# Altium schematic sheet ST-Link_V2.SchDoc
size A4; SheetNumber: 3; SheetTotal: 6
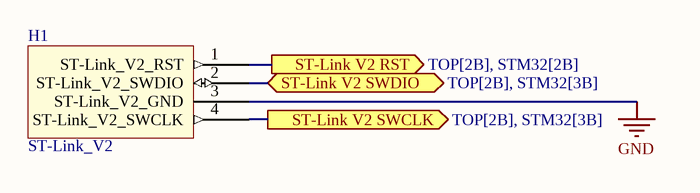
[diagram p0: ST-Link_V2.SchDoc]

## Parts
H1  ST-Link_V2  [4pin]

## Ports
ST-Link V2 RST (out, see TOP[2B], STM32[2B]), ST-Link V2 SWCLK (out, see TOP[2B], STM32[3B]), ST-Link V2 SWDIO (bidir, see TOP[2B], STM32[3B])

## Nets
GND: H1.3(ST-Link_V2_GND)
ST-Link V2 RST: H1.1(ST-Link_V2_RST) ; port ST-Link V2 RST
ST-Link V2 SWCLK: H1.4(ST-Link_V2_SWCLK) ; port ST-Link V2 SWCLK
ST-Link V2 SWDIO: H1.2(ST-Link_V2_SWDIO) ; port ST-Link V2 SWDIO